# EAGLE design LRT1919 (EAGLE 9.6.1)
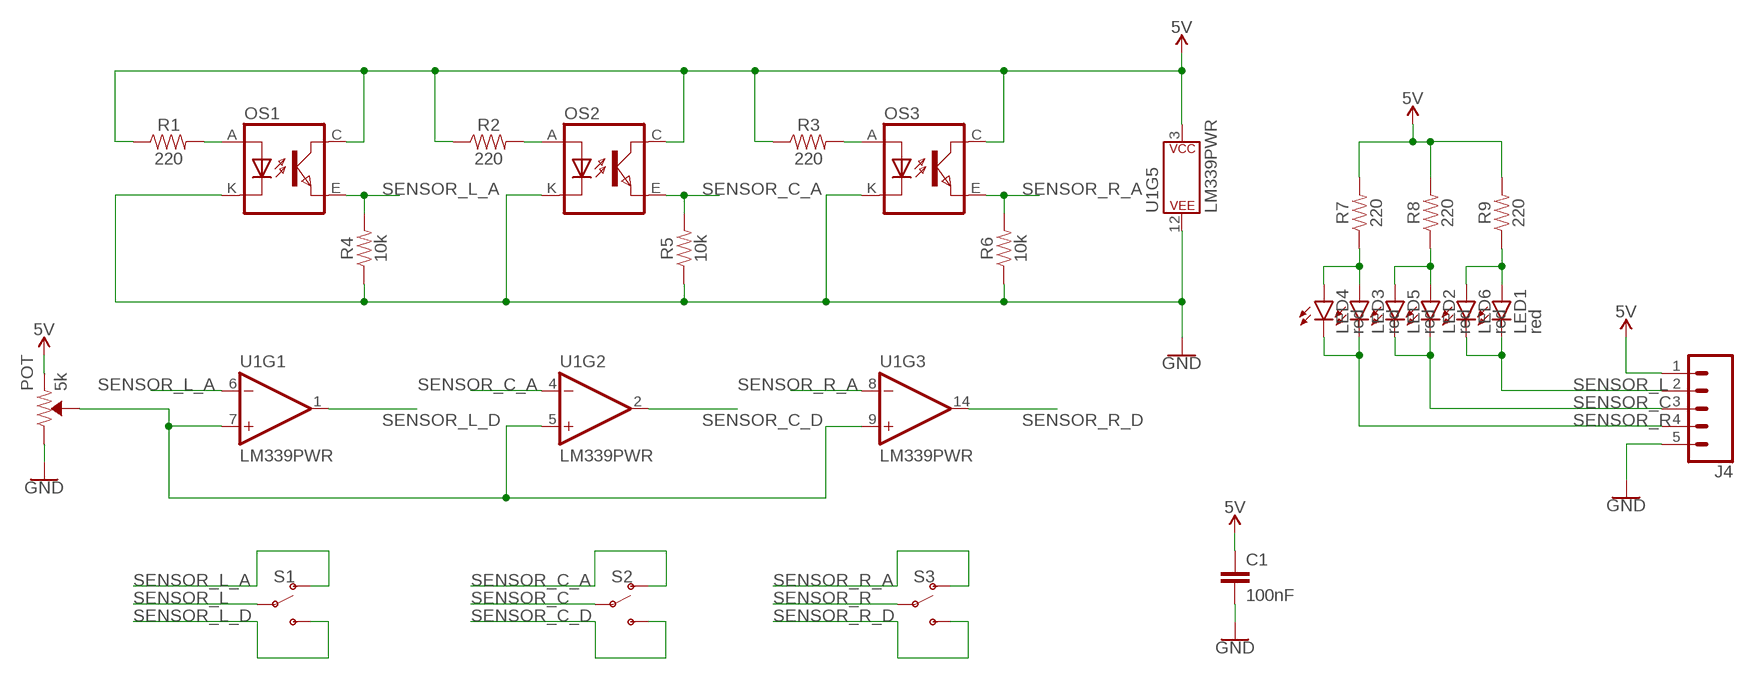
[diagram p0: schematic, sheet 1]

## Parts
C1  100nF  0.33UF/330NF-0805-50V-10%  [0805]
J4  CONN_05  [1X05]
LED1  red  LEDSML0805  [SML0805]
LED2  red  LEDSML0805  [SML0805]
LED3  red  LEDSML0805  [SML0805]
LED4  red  LEDSML0805  [SML0805]
LED5  red  LEDSML0805  [SML0805]
LED6  red  LEDSML0805  [SML0805]
OS1  TCRT5000  [TCRT5000]
OS2  TCRT5000  [TCRT5000]
OS3  TCRT5000  [TCRT5000]
POT  5k  TRIMPOT-SMD-5MM-CLOSED-1/4W-20%  [TRIMPOT-SMD-5MM]
R1  220  0.22OHM-0805-1/4W-1%  [0805]
R2  220  0.22OHM-0805-1/4W-1%  [0805]
R3  220  0.22OHM-0805-1/4W-1%  [0805]
R4  10k  0.22OHM-0805-1/4W-1%  [0805]
R5  10k  0.22OHM-0805-1/4W-1%  [0805]
R6  10k  0.22OHM-0805-1/4W-1%  [0805]
R7  220  0.22OHM-0805-1/4W-1%  [0805]
R8  220  0.22OHM-0805-1/4W-1%  [0805]
R9  220  0.22OHM-0805-1/4W-1%  [0805]
S1  SWITCH-SPDT-SMD-RIGHT-ANGLE  [SWITCH_SPST_SMD_A]
S2  SWITCH-SPDT-SMD-RIGHT-ANGLE  [SWITCH_SPST_SMD_A]
S3  SWITCH-SPDT-SMD-RIGHT-ANGLE  [SWITCH_SPST_SMD_A]
U1  LM339PWR  LM339  [TSSOP-14]

## Nets
5V: C1.1 J4.1 OS1.C(COLLECTOR) OS2.C(COLLECTOR) OS3.C(COLLECTOR) POT.A(CCW) R1.1 R2.1 R3.1 R7.2 R8.2 R9.2 U1.3(P$V+)
GND: C1.2 J4.5 OS1.K(CATHODE) OS2.K(CATHODE) OS3.K(CATHODE) POT.C(CW) R4.1 R5.1 R6.1 U1.12(P$V-)
N$1: OS1.A(ANODE) R1.2
N$2: OS2.A(ANODE) R2.2
N$3: OS3.A(ANODE) R3.2
N$4: LED3.A LED4.A R7.1
N$5: LED2.A LED5.A R8.1
N$6: POT.B(WIPER) U1.5(+IN) U1.7(+IN) U1.9(+IN)
N$7: LED1.A LED6.A R9.1
SENSOR_C: J4.3 LED2.C LED5.C S2.2(P)
SENSOR_C_A: OS2.E(EMITTER) R5.2 S2.1(O) U1.4(-IN)
SENSOR_C_D: S2.3(S) U1.2(OUT)
SENSOR_L: J4.2 LED1.C LED6.C S1.2(P)
SENSOR_L_A: OS1.E(EMITTER) R4.2 S1.1(O) U1.6(-IN)
SENSOR_L_D: S1.3(S) U1.1(OUT)
SENSOR_R: J4.4 LED3.C LED4.C S3.2(P)
SENSOR_R_A: OS3.E(EMITTER) R6.2 S3.1(O) U1.8(-IN)
SENSOR_R_D: S3.3(S) U1.14(OUT)
Unconnected: U1.10(-IN) U1.11(+IN) U1.13(OUT)

## Library data of the parts
C1 = SparkFun-Capacitors:0.33UF/330NF: 0.33µF/330nF ceramic capacitors A capacitor is a passive two-terminal electrical component used to store electrical energy temporarily in an electric field.; PROD_ID: CAP-08469; VALUE: 0.33µF
J4 = SparkFun-Connectors:CONN_05: Multi connection point. Often used as Generic Header-pin footprint for 0.1 inch spaced/style header connections On any of the 0.1 inch spaced packages, you can populate with these: Break Away Headers - Straight <https://www.sparkfun.com/products/116> (PRT-00116) Break Away Male Headers - Right Angle <https://www.sparkfun.com/products/553> (PRT-00553) Female Headers <https://www.sparkfun.com/products/115> (PRT-00115) Break Away Headers - Machine Pin <https://www.sparkfun.com/products/117> (PRT-00117) Break Away Female Headers - Swiss Machine Pin <https://www.sparkfun.com/products/743> (PRT-00743) For SCREWTERMINALS and SPRING TERMINALS visit here: Screw Terimnals on SparkFun.com <https://www.sparkfun.com/search/results?term=Screw+Terminals> (5mm/3.5mm/2.54mm spacing) This device is also useful as a general connection point to wire up your design to another part of your project. Our various solder wires solder well into these plated through hole pads. Hook-Up Wire - Assortment (Stranded, 22 AWG) <https://www.sparkfun.com/products/11375> (PRT-11375) Hook-Up Wire - Assortment (Solid Core, 22 AWG) <https://www.sparkfun.com/products/11367> (PRT-11367) View the entire wire category on our website here <https://www.sparkfun.com/categories/141> Special notes: Molex polarized connector foot print use with SKU : PRT-08231 with associated crimp pins and housings. 1MM SMD Version SKU: PRT-10208
LED1-LED6 = led:LED: LED OSRAM: - CHIPLED LG R971, LG N971, LY N971, LG Q971, LY Q971, LO R971, LY R971 LH N974, LH R974 LS Q976, LO Q976, LY Q976 LO Q996 - Hyper CHIPLED LW Q18S LB Q993, LB Q99A, LB R99A - SideLED LS A670, LO A670, LY A670, LG A670, LP A670 LB A673, LV A673, LT A673, LW A673 LH A674 LY A675 LS A676, LA A676, LO A676, LY A676, LW A676 LS A679, LY A679, LG A679 - Hyper Micro SIDELED® LS Y876, LA Y876, LO Y876, LY Y876 LT Y87S - SmartLED LW L88C, LW L88S LB L89C, LB L89S, LG L890 LS L89K, LO L89K, LY L89K LS L896, LA L896, LO L896, LY L896 - TOPLED LS T670, LO T670, LY T670, LG T670, LP T670 LSG T670, LSP T670, LSY T670, LOP T670, LYG T670 LG T671, LOG T671, LSG T671 LB T673, LV T673, LT T673, LW T673 LH T674 LS T676, LA T676, LO T676, LY T676, LB T676, LH T676, LSB T676, LW T676 LB T67C, LV T67C, LT T67C, LS T67K, LO T67K, LY T67K, LW E67C LS E67B, LA E67B, LO E67B, LY E67B, LB E67C, LV E67C, LT E67C LW T67C LS T679, LY T679, LG T679 LS T770, LO T770, LY T770, LG T770, LP T770 LB T773, LV T773, LT T773, LW T773 LH T774 LS E675, LA E675, LY E675, LS T675 LS T776, LA T776, LO T776, LY T776, LB T776 LHGB T686 LT T68C, LB T68C - Hyper Mini TOPLED® LB M676 - Mini TOPLED Santana® LG M470 LS M47K, LO M47K, LY M47K Source: http://www.osram.convergy.de LUXEON: - LUMILED® LXK2-PW12-R00, LXK2-PW12-S00, LXK2-PW14-U00, LXK2-PW14-V00 LXK2-PM12-R00, LXK2-PM12-S00, LXK2-PM14-U00 LXK2-PE12-Q00, LXK2-PE12-R00, LXK2-PE12-S00, LXK2-PE14-T00, LXK2-PE14-U00 LXK2-PB12-K00, LXK2-PB12-L00, LXK2-PB12-M00, LXK2-PB14-N00, LXK2-PB14-P00, LXK2-PB14-Q00 LXK2-PR12-L00, LXK2-PR12-M00, LXK2-PR14-Q00, LXK2-PR14-R00 LXK2-PD12-Q00, LXK2-PD12-R00, LXK2-PD12-S00 LXK2-PH12-R00, LXK2-PH12-S00 LXK2-PL12-P00, LXK2-PL12-Q00, LXK2-PL12-R00 Source: www.luxeon.com KINGBRIGHT: KA-3528ASYC Source: www.kingbright.com
OS1-OS3 = tcrt5000:TCRT5000
POT = SparkFun-Resistors:TRIMPOT: Trimming Potentiometer (Trimpot) Three-terminal potentiometers, with an adjustable wiper and two adjustable resistors. A pot can be used to create a configurable voltage divider, or as a variable resistor. "Trimpots" are a subset of potentiometers, usually intended for "set-and-forget" applications. They're often more delicate than standard potentiometers - rated for fewer turns. Variants PTH-KNOB - PTH Trimpot w/ finger-adjustable knob Trimpot 10K with Knob <https://www.sparkfun.com/products/9806> (COM-09806) Datasheet <http://www.sparkfun.com/datasheets/Components/General/TSR-3386.pdf> SMD-3MM-CLOSED-FRAME - SMD 3mm Square Closed-Frame Trimpot Used on e.g. EasyDriver - Stepper Motor Driver <https://www.sparkfun.com/products/12779> Datasheet <http://www.bitechnologies.com/pdfs/22.pdf> (22AR10KTR) SMD-5MM - SMD 5mm Square Closed-Frame Trimpot Used on e.g. IOIO-OTG - V2.2 <https://www.sparkfun.com/products/13613> Datasheet <http://www.vishay.com/docs/51008/ts53.pdf> (TS53YL502MR10) SMD-3MM-1/10W-25% - 3mm Square Open-Frame Trimpot Used on e.g. SparkFun Shapeoko <https://www.sparkfun.com/products/13899> Datasheet <http://www.bourns.com/docs/Product-Datasheets/TC33.pdf> (TC33X-2-103E); PROD_ID: RES-11156
R1-R9 = SparkFun-Resistors:0.22OHM: 0.22Ω resistor A resistor is a passive two-terminal electrical component that implements electrical resistance as a circuit element. Resistors act to reduce current flow, and, at the same time, act to lower voltage levels within circuits. - Wikipedia; PROD_ID: RES-09883; VALUE: 0.22
S1-S3 = SparkFun-Switches:SWITCH-SPDT: Single Pole, Double Throw (SPDT) Switch Single-pole, double-throw (SPDT) switch. Variant Overview SMD-AYZ0202 Surface Mount DPDT Switch <https://www.sparkfun.com/products/597> (COM-00597) Used on e.g. LilyPad Arduino USB - ATmega32U4 Board <https://www.sparkfun.com/products/12049> PTH-11.6X4.0MM SPDT Mini Power Switch <https://www.sparkfun.com/products/102> (COM-00102) Used on e.g. SparkFun Simon Says - Through-Hole Soldering Kit <https://www.sparkfun.com/products/10547> (KIT-10547) PTH-11.6X4.0MM-KIT KIT version of SPDT Mini Power Switch - Simplifies soldering by removing tStop of switch pins - only one side can be soldered. PTH-11.6X4.0MM-LOCK LOCK version of SPDT Mini Power Switch - Offset pins hold switch in place for easier soldering. SMD-RIGHT-ANGLE Surface Mount Right Angle Switch <https://www.sparkfun.com/products/10860> (COM-10860) Used on e.g. SparkFun ESP8266 Thing <https://www.sparkfun.com/products/13231>; PROD_ID: SWCH-10651; SF_SKU: COM-10860
U1 = SparkFun-IC-Amplifiers:LM339: Quad Comparator - LM339PWR Based on information from the SLCS006N datasheet from TI (www.ti.com). Created by nick@scantool.net, 2008. Updated 2016. SparkFun Products SparkFun OBD-II UART <https://www.sparkfun.com/products/9555> (WIG-09555) SparkFun Car Diagnostics Kit <https://www.sparkfun.com/products/10769> (RTL-10769); PROD_ID: IC-09990

## Board
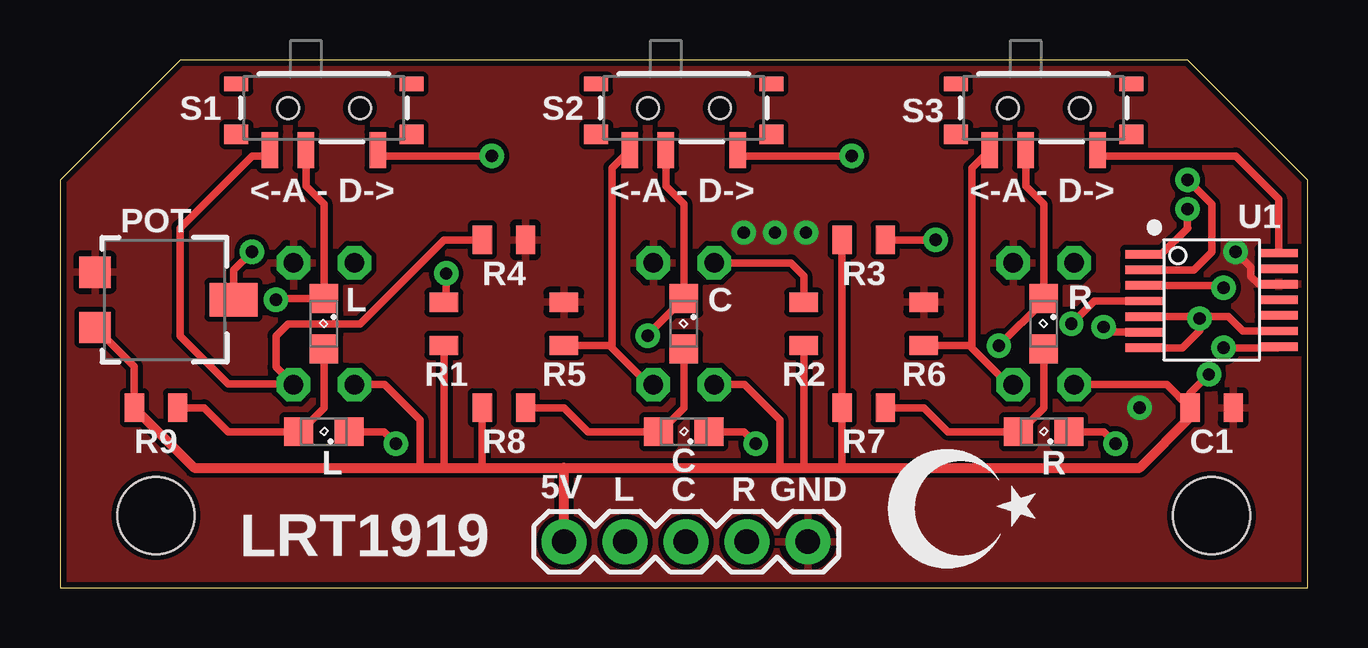
[diagram p1: board, top side]
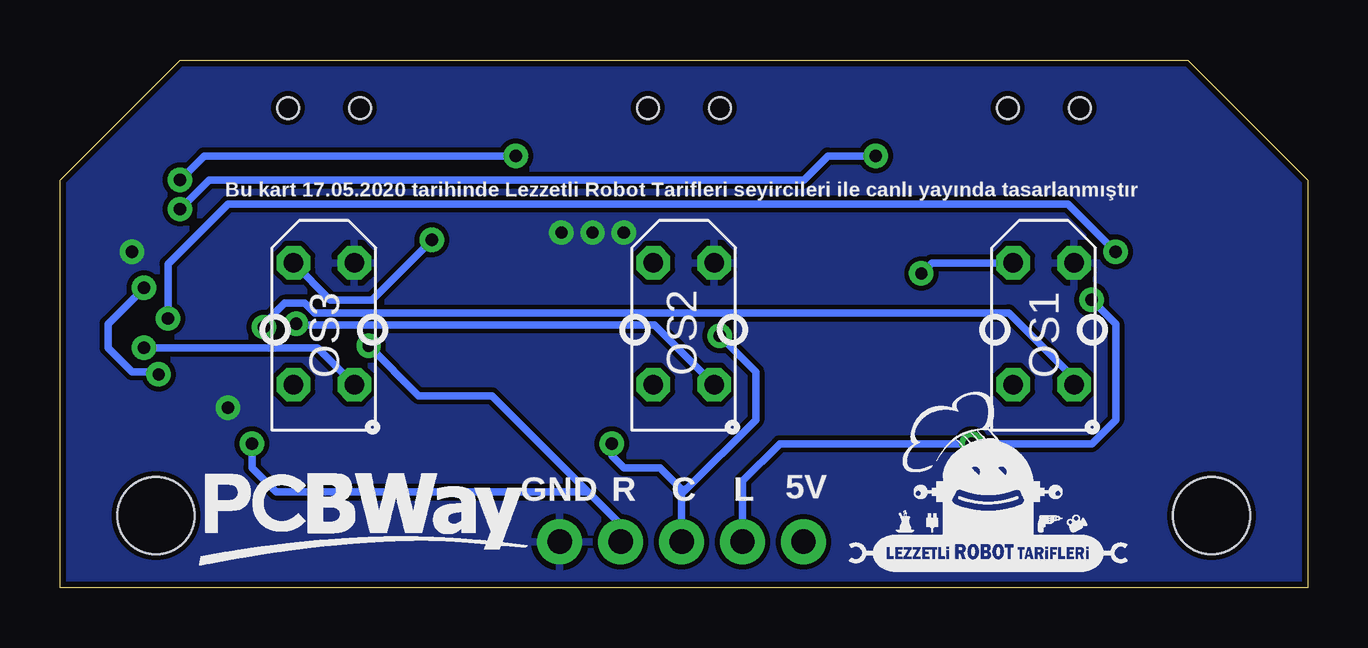
[diagram p2: board, bottom side, seen from below]

Size 52 x 22 mm. Coordinates in mm from the lower left corner, seen from the top.
Outline: 0,0 52,0 52,17 47,22 5,22 0,17 0,0
Copper layers (1*16): Top 0.035mm / dielectric 1.5mm / Bottom 0.035mm
Design rules "SparkFun": minimum track width 8mil, minimum drill 20mil, track to track 8mil, track to pad 8mil, pad to pad 8mil, via to via 8mil, smd to smd 8mil, copper to edge 10mil, drill to drill 8mil, minimum pad ring 12mil, minimum via ring 10mil, stop-mask expansion 4mil, vias tented up to drill 25mil, thermal gap 10mil
Holes 3.2 mm at 4,3 48,3

### Footprints (pad centres in the part's own frame; a part is rotated, then mirrored left to right if it is on the bottom)
0805 = smd 0.8 x 1.2: 1 -0.9,0; 2 0.9,0
1X05 = drill 1.016 pad 1.88: 1 0,0; 2 2.54,0; 3 5.08,0; 4 7.62,0; 5 10.16,0
SML0805 = smd 1.2 x 1.2: A 1.05,0; C -1.05,0
TCRT5000 = drill 0.8 octagon: A -2.54,-1.27; C 2.54,-1.27; E 2.54,1.27; K -2.54,1.27
TRIMPOT-SMD-5MM = smd 1.3 x 1.3: A 1.15,-2.54; C -1.15,-2.54 | smd 1.402 x 2: B 0,3.239
SWITCH_SPST_SMD_A = smd 0.7 x 1.5: 1 -2.25,-1.75; 2 -0.75,-1.75; 3 2.25,-1.75 | smd 1 x 0.6: GND1 -3.65,1; GND3 3.65,1 | smd 1 x 0.8: GND2 -3.65,-1.1; GND4 3.65,-1.1 | hole 0.9: -1.5,0; 1.5,0
TSSOP-14 = smd 1.6 x 0.35: 1 -2.8,1.9; 2 -2.8,1.25; 3 -2.8,0.6; 4 -2.8,-0.05; 5 -2.8,-0.7; 6 -2.8,-1.35; 7 -2.8,-2; 8 2.8,-1.95; 9 2.8,-1.3; 10 2.8,-0.65; 11 2.8,0; 12 2.8,0.65; 13 2.8,1.3; 14 2.8,1.95

### Placement (x,y rotation side)
C1  48,7.5 0 top
J4  21.01,1.91 0 top
LED1  11,11 270 top
LED2  26,11 270 top
LED3  41,11 270 top
LED4  41,6.5 180 top
LED5  26,6.5 180 top
LED6  11,6.5 180 top
OS1  11,11 270 bottom
OS2  26,11 270 bottom
OS3  41,11 270 bottom
POT  4,12 270 top
R1  16,11 90 top
R2  31,11 90 top
R3  33.5,14.5 0 top
R4  18.5,14.5 180 top
R5  21,11 270 top
R6  36,11 270 top
R7  33.5,7.5 180 top
R8  18.5,7.5 180 top
R9  4,7.5 180 top
S1  11,20 0 top
S2  26,20 0 top
S3  41,20 0 top
U1  48,12 0 top
U$2  [LOGO0.001]  19.1,0.67 0 bottom
U$3  [PCBWAY_LOGO_0.01]  46.92,-2.48 0 bottom
U$5  [TR_MINI]  33.33,0.25 0 top

### Tracks (layer width: path | path; a pad name or v marks a point on that pad's centre or on a via)
5V  (via drill 0.51)
  Top 0.305: POT.A 3.1,9.21 R9.2 | R8.2 17.6,5.1 17.5,5 | R1.1 16,5 | R2.1 31,5 | 32.5,5 32.6,5.1 R7.2 R3.1 | U1.3 48.4,12.6 v48.5,12.5 | OS1.C 13.54,8.46 15,7 15,5 | OS2.C 28.54,8.46 30,7 30,5 | OS3.C 46.14,8.46 C1.1 47.1,8.1 v47.89,8.89
  Top 0.406: J4.1 21,5 | 21,5 30,5 31,5 32.5,5 45,5 47.1,7.1 C1.1 | R9.2 5.6,5 15,5 16,5 17.5,5 21,5
  Bottom 0.305: v48.5,12.5 50,11 50,10 49,9 48,9 v47.89,8.89
GND  (via drill 0.51)
  Top 0.305: v49,14 49.64,13.36 49.64,12.98 49.97,12.65 U1.12
  other vias: 45,7.5 28.5,14.8 29.8,14.8 31.1,14.8
  pour Bottom: 55,25 -3,25 -3,-3 55,-3
  pour Top: -2,-2 -2,24 54,24 54,-2
N$1  (via drill 0.51)
  Top 0.305: v16.1,13.1 16.1,12 R1.2
  Bottom 0.305: OS1.A 15.66,13.54 v16.1,13.1
N$2
  Top 0.305: OS2.A 30.46,13.54 31,13 R2.2
N$3  (via drill 0.51)
  Top 0.305: R3.2 v36.5,14.5
  Bottom 0.305: OS3.A 40.73,12 39,12 v36.5,14.5
N$4
  Top 0.305: LED3.A 41,7.5 40,6.5 LED4.A 37,6.5 36,7.5 R7.1
N$5
  Top 0.305: LED2.A 26,7.5 25,6.5 LED5.A 22,6.5 21,7.5 R8.1
N$6  (via drill 0.51)
  Top 0.305: POT.B 7.24,13.24 v8,14 | U1.9 49.3,10.7 48.7,11.3 47.42,11.3 | U1.5 47.42,11.3 | 47.42,11.3 v47.5,11.22 47.5,10.72 46.78,10 U1.7
  Bottom 0.305: v8,14 10,16 45,16 47.5,13.5 v47.5,11.22
N$7
  Top 0.305: LED1.A 11,7.5 10,6.5 LED6.A 7,6.5 6,7.5 R9.1
SENSOR_C  (via drill 0.51)
  Top 0.305: S2.2 25.25,16.75 26,16 LED2.C 24.5,10.55 v24.5,10.5 | LED5.C 28.5,6.5 v29,6
  Bottom 0.305: J4.3 26.09,3.91 | 26.09,3.91 26.09,4.09 | 26.09,4.09 27,5 28.5,5 29,5.5 v29,6 | v24.5,10.5 23,9 23,7 25.91,4.09 | 25.91,4.09 26.09,4.09 | 25.91,4.09 26.09,3.91
SENSOR_C_A  (via drill 0.51)
  Top 0.305: v42.16,11 43.11,11.95 U1.4 | S2.1 23,17.5 23,10 | 23,10 24.54,8.46 OS2.E | R5.2 22.9,10.1 23,10
  Bottom 0.305: OS2.E 27.22,10.95 42.11,10.95 v42.16,11
SENSOR_C_D  (via drill 0.51)
  Top 0.305: v33,18 28.5,18 S2.3 | v47,17 48,16 48,14 47.25,13.25 U1.2
  Bottom 0.305: v33,18 46,18 v47,17
SENSOR_L  (via drill 0.51)
  Top 0.305: S1.2 10.25,16.75 11,16 LED1.C 9.05,12.05 v9,12 | LED6.C 13.5,6.5 v14,6
  Bottom 0.305: J4.2 23.55,4.45 22,6 v14,6 9,6 8,7 8,11 v9,12
SENSOR_L_A  (via drill 0.51)
  Top 0.305: U1.6 43.71,10.65 v43.5,10.86 | S1.1 8.75,18 8,18 5,15 5,10.5 7,8.5 9.69,8.5 | 9.69,8.5 OS1.E | R4.2 16,14.5 12.5,11 9.5,11 9,10.5 9,9.19 9.69,8.5
  Bottom 0.305: OS1.E 9.73,8.73 12.46,11.46 41.39,11.46 41.8,11.86 42.64,11.86 43.5,11 v43.5,10.86
SENSOR_L_D  (via drill 0.51)
  Top 0.305: S1.3 13.25,18 v18,18 | v47,15.78 47,15 45.9,13.9 U1.1
  Bottom 0.305: v47,15.78 45.78,17 21,17 20,18 v18,18
SENSOR_R  (via drill 0.51)
  Top 0.305: S3.2 40.25,16.75 41,16 LED3.C 41,11.95 v39.14,10.09 | LED4.C 43.5,6.5 v44,6
  Bottom 0.305: v44,6 44,5 43,4 30,4 | J4.4 28.63,2.63 30,4 | 30,4 34,8 37.05,8 v39.14,10.09
SENSOR_R_A  (via drill 0.51)
  Top 0.305: U1.8 50.75,10 v48.5,10 | S3.1 38,17.5 38,10 | 38,10 39.54,8.46 OS3.E | R6.2 37.9,10.1 38,10
  Bottom 0.305: OS3.E 41.27,10 v48.5,10
SENSOR_R_D
  Top 0.305: S3.3 43.5,18 49,18 50.8,16.2 U1.14

### Text on the board
tPlace: <-A - D-> | <-A - D-> | <-A - D-> | R | L | C | L | C | R | 5V | L | C | R | GND | LRT1919
bPlace: Bu kart 17.05.2020 tarihinde Lezzetli Robot Tarifleri seyircileri ile canlı yayında tasarlanmıştır | 5V | L | C | R | GND